# EAGLE design dac_board (EAGLE 8.0.1)
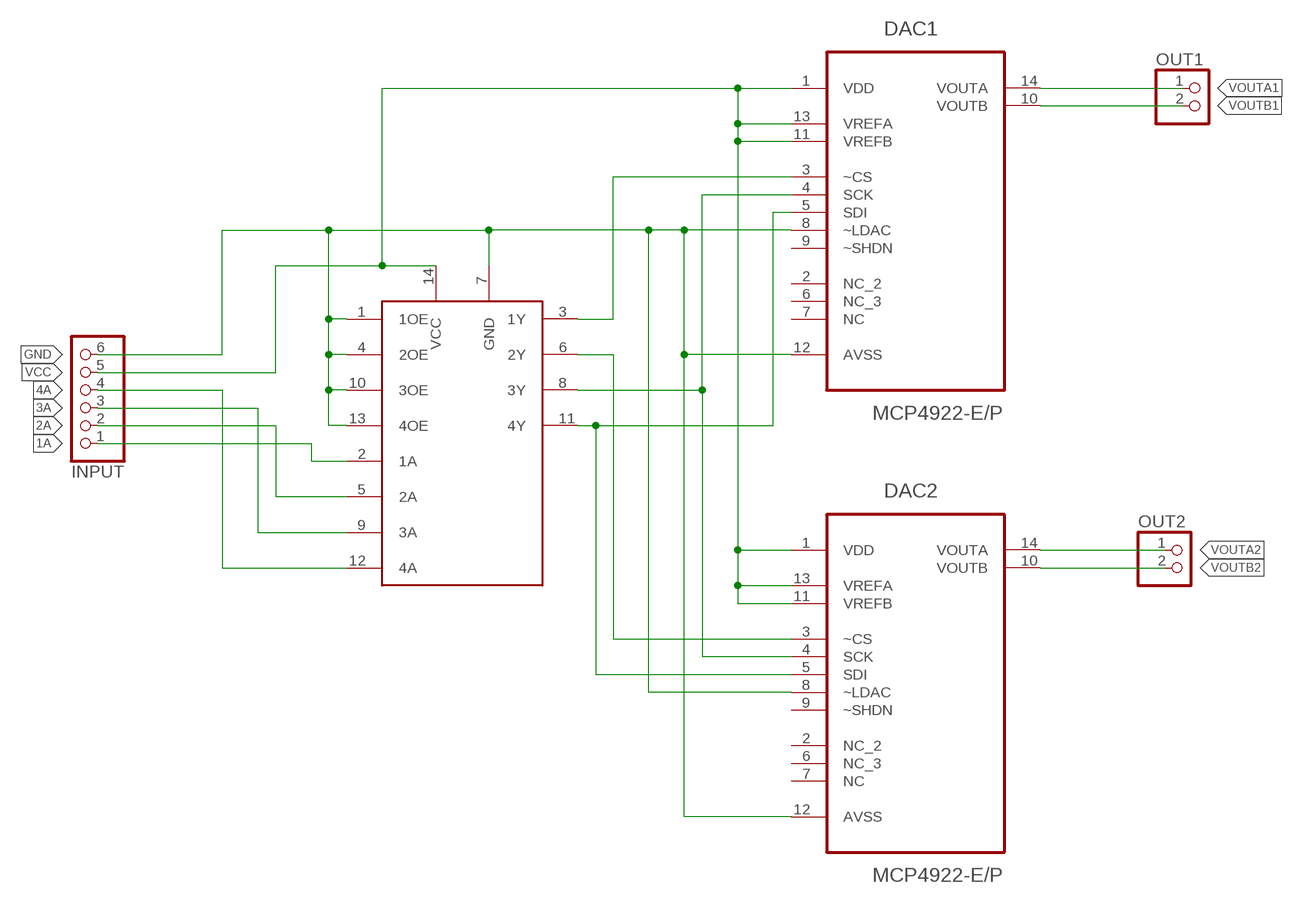
[diagram p0: schematic, sheet 1]

## Parts
DAC1  MCP4922-E/P  [DIP254P762X533-14]
DAC2  MCP4922-E/P  [DIP254P762X533-14]
INPUT  PINHD-1X6  [1X06]
LLS  SN74AHCT125  [DIP762W46P254L1930H508Q14]
OUT1  PINHD-1X2  [1X02]
OUT2  PINHD-1X2  [1X02]

## Nets
1A: INPUT.1 LLS.2(1A)
1Y: DAC1.3(~CS) LLS.3(1Y)
2A: INPUT.2 LLS.5(2A)
2Y: DAC2.3(~CS) LLS.6(2Y)
3A: INPUT.3 LLS.9(3A)
3Y: DAC1.4(SCK) DAC2.4(SCK) LLS.8(3Y)
4A: INPUT.4 LLS.12(4A)
4Y: DAC1.5(SDI) DAC2.5(SDI) LLS.11(4Y)
GND: DAC1.8(~LDAC) DAC1.12(AVSS) DAC2.8(~LDAC) DAC2.12(AVSS) INPUT.6 LLS.1(1OE) LLS.4(2OE) LLS.7(GND) LLS.10(3OE) LLS.13(4OE)
VCC: DAC1.1(VDD) DAC1.11(VREFB) DAC1.13(VREFA) DAC2.1(VDD) DAC2.11(VREFB) DAC2.13(VREFA) INPUT.5 LLS.14(VCC)
VOUTA1: DAC1.14(VOUTA) OUT1.1
VOUTA2: DAC2.14(VOUTA) OUT2.1
VOUTB1: DAC1.10(VOUTB) OUT1.2
VOUTB2: DAC2.10(VOUTB) OUT2.2
Unconnected: DAC1.2(NC_2) DAC1.6(NC_3) DAC1.7(NC) DAC1.9(~SHDN) DAC2.2(NC_2) DAC2.6(NC_3) DAC2.7(NC) DAC2.9(~SHDN)

## Library data of the parts
DAC1 DAC2 = MCP4922-E_P:MCP4922-E/P: 12-Bit DAC; AVAILABILITY: Good; DESCRIPTION: MCP4922 Series 2 Ch 12-Bit Voltage Output Digital-to-Analog Converter-PDIP-14; MF: Microchip; MP: MCP4922-E/P; PACKAGE: DIP-14 Microchip; PRICE: 2.40 USD
INPUT = pinhead:PINHD-1X6: PIN HEADER
LLS = SN74AHCT125N:SN74AHCT125: Quadruple bus buffer gates (logic level shifter)
OUT1 OUT2 = pinhead:PINHD-1X2: PIN HEADER

## Board
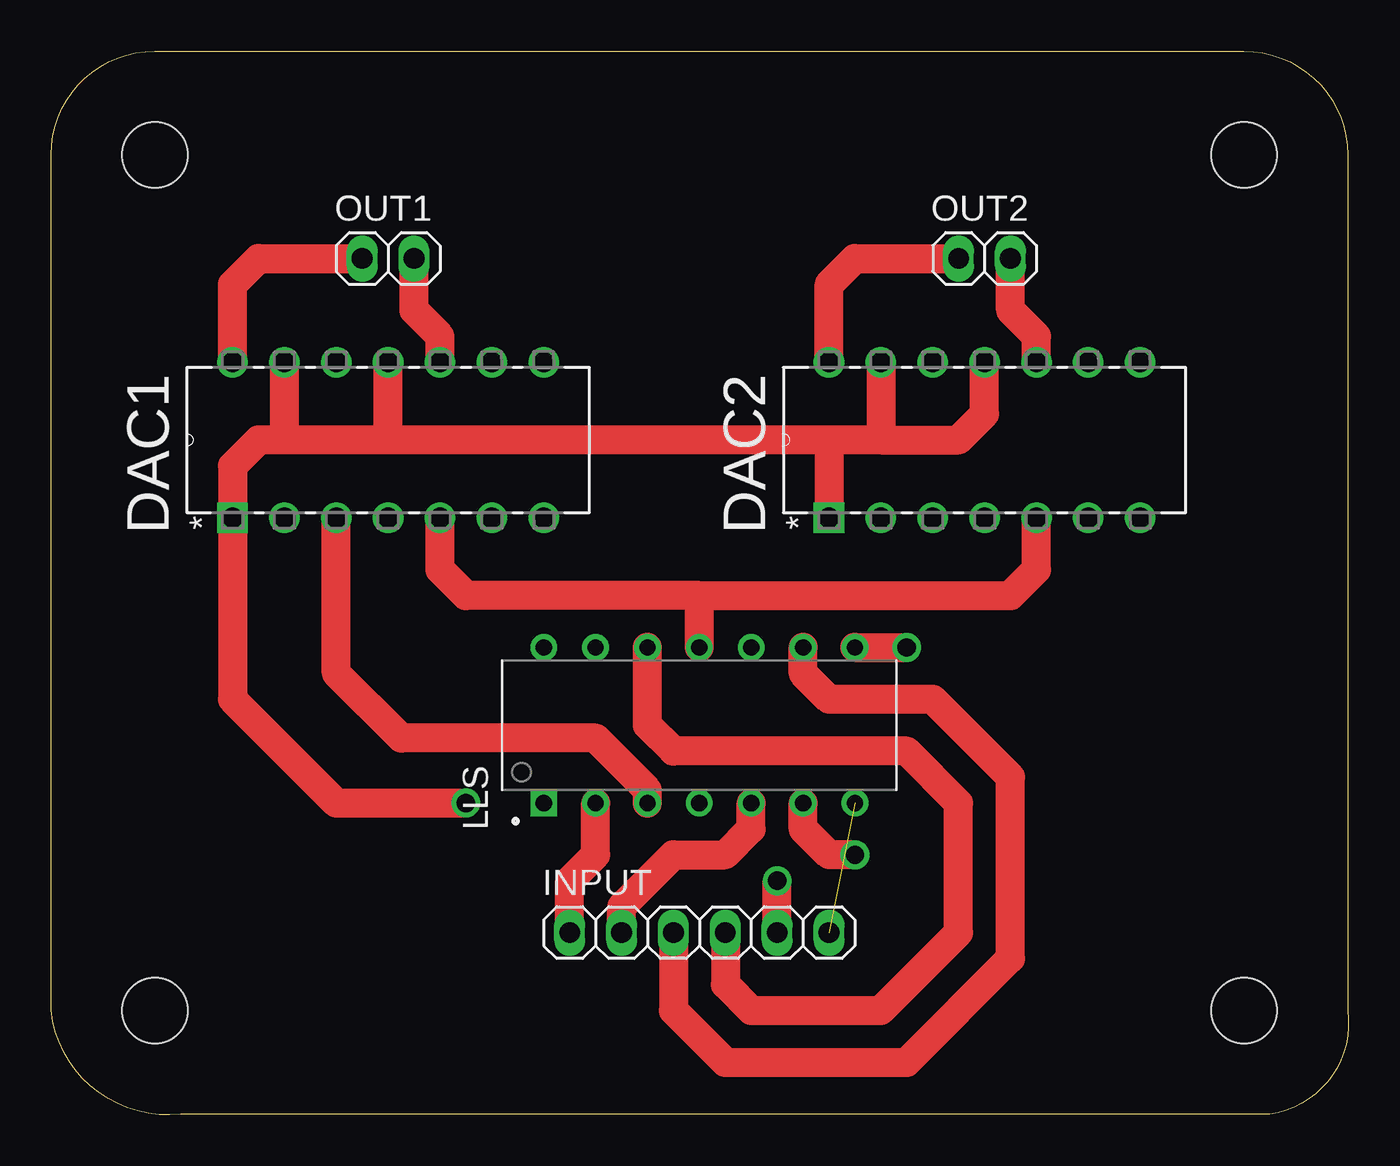
[diagram p1: board, top side]
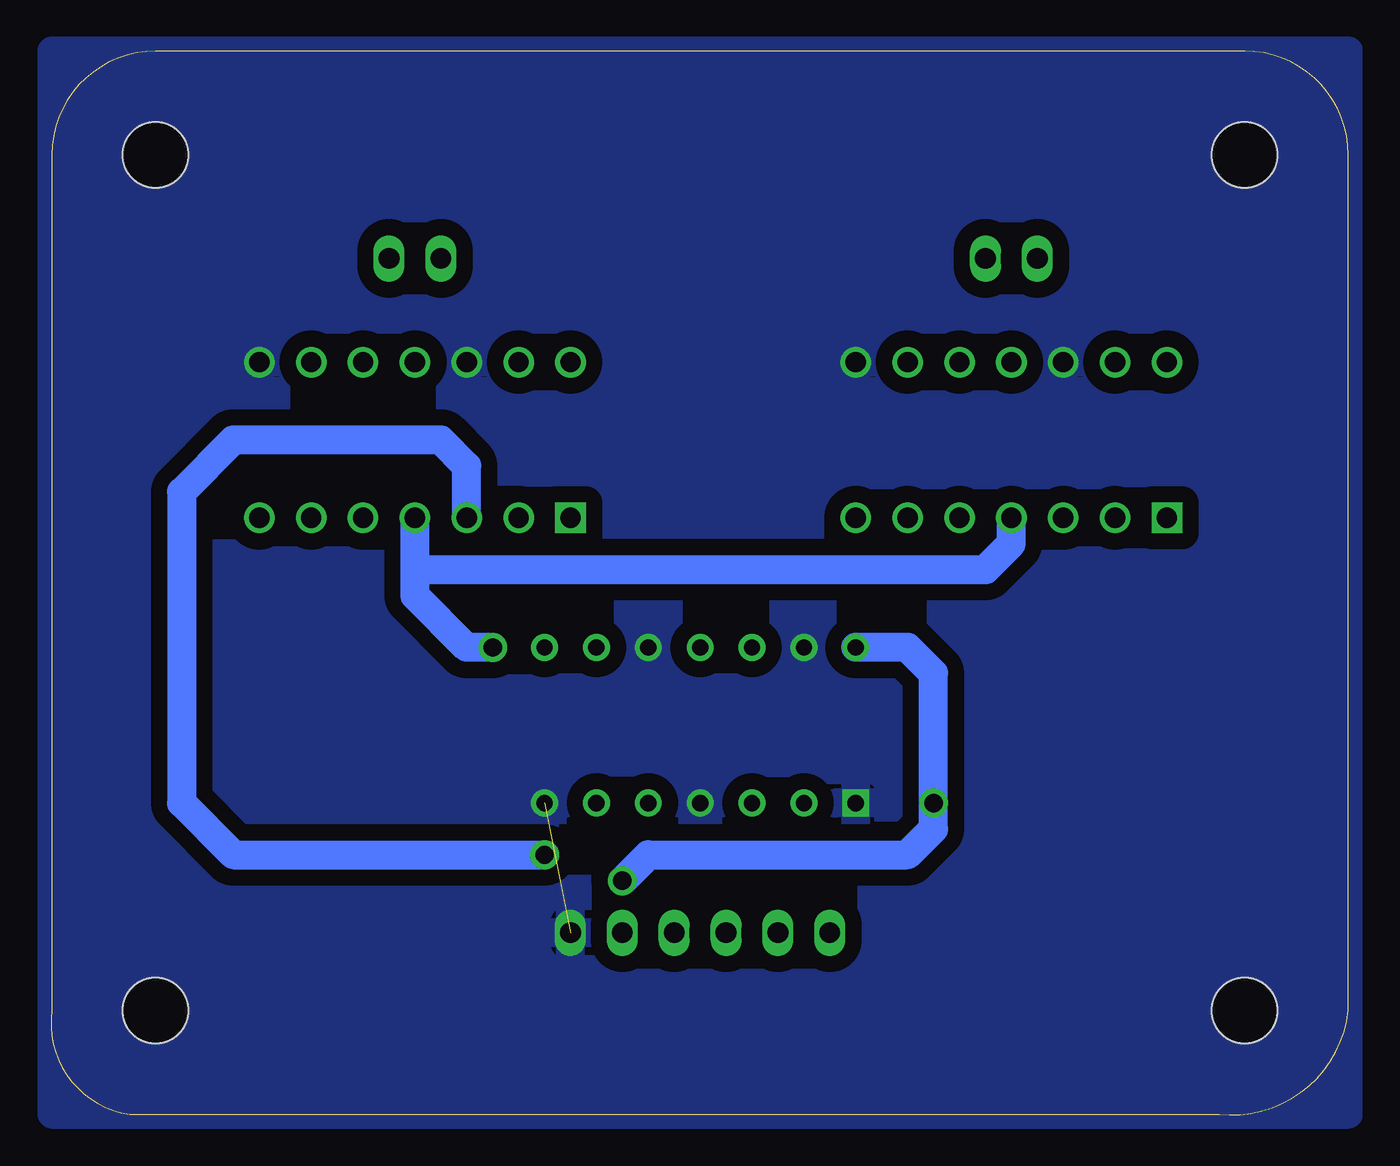
[diagram p2: board, bottom side, seen from below]

Size 63.54 x 52.1 mm. Coordinates in mm from the lower left corner, seen from the top.
Outline: 0,5.11 0,47.02 arc-90 5.08,52.1 58.42,52.1 arc-90 63.5,47.02 63.5,5.11 arc-90 59.69,0.03 6.35,0.03 arc-90 0,5.11
Copper layers (1*16): Top 0.035mm / dielectric 1.5mm / Bottom 0.035mm
Design rules "OthermillDRC_1_32_v2": minimum track width 8mil, minimum drill 0.8mm, track to track 0.794003125mm, track to pad 0.794003125mm, pad to pad 0.794003125mm, via to via 0.794003125mm, smd to smd 0mil, copper to edge 0mil, drill to drill 1mil, minimum pad ring 10mil, minimum via ring 10mil, stop-mask expansion 1mil, vias tented up to drill 30mil, thermal gap 10mil
Holes 3.2 mm at 5.08,47.02 58.42,47.02 58.42,5.11 5.08,5.11

### Footprints (pad centres in the part's own frame; a part is rotated, then mirrored left to right if it is on the bottom)
DIP254P762X533-14 = drill 0.991 square: 1 -7.62,15.24 | drill 0.991: 2 -7.62,12.7; 3 -7.62,10.16; 4 -7.62,7.62; 5 -7.62,5.08; 6 -7.62,2.54; 7 -7.62,0; 8 0,0; 9 0,2.54; 10 0,5.08; 11 0,7.62; 12 0,10.16; 13 0,12.7; 14 0,15.24
1X06 = drill 1.016 long: 1 -6.35,0; 2 -3.81,0; 3 -1.27,0; 4 1.27,0; 5 3.81,0; 6 6.35,0
DIP762W46P254L1930H508Q14 = drill 0.8 square: 1 -3.81,7.62 | drill 0.8: 2 -3.81,5.08; 3 -3.81,2.54; 4 -3.81,0; 5 -3.81,-2.54; 6 -3.81,-5.08; 7 -3.81,-7.62; 8 3.81,-7.62; 9 3.81,-5.08; 10 3.81,-2.54; 11 3.81,0; 12 3.81,2.54; 13 3.81,5.08; 14 3.81,7.62
1X02 = drill 1.016 long: 1 -1.27,0; 2 1.27,0

### Placement (x,y rotation side)
DAC1  24.13,36.86 90 top
DAC2  53.34,36.86 90 top
INPUT  31.75,8.92 0 top
LLS  31.75,19.08 90 top
OUT1  16.51,41.94 0 top
OUT2  45.72,41.94 0 top

### Tracks (layer width: path | path; a pad name or v marks a point on that pad's centre or on a via)
1A
  Top 1.422: INPUT.1 25.4,11.46 26.67,12.73 LLS.2
1Y
  Top 1.422: LLS.3 29.21,15.91 26.67,18.45 17.14,18.45 13.97,21.62 DAC1.3
2A
  Top 1.422: INPUT.2 27.94,10.19 30.48,12.73 33.02,12.73 34.29,14 LLS.5
2Y  (via drill 0.9)
  Top 1.422: v39.37,12.73 38.1,12.73 36.83,14 LLS.6
  Bottom 1.422: DAC2.3 43.18,31.78 44.45,33.05 54.61,33.05 57.15,30.51 57.15,15.27 54.61,12.73 v39.37,12.73
3A
  Top 1.422: INPUT.3 30.48,5.11 33.02,2.57 41.91,2.57 46.99,7.65 46.99,16.54 43.18,20.35 38.1,20.35 36.83,21.62 LLS.9
3Y  (via drill 0.9)
  Top 1.422: LLS.8 v41.91,22.89
  Bottom 1.422: v41.91,22.89 43.18,22.89 45.72,25.43 45.72,26.7 | 45.72,26.7 DAC2.4 | 45.72,26.7 17.78,26.7 16.51,27.97 DAC1.4
4A
  Top 1.422: INPUT.4 33.02,6.38 34.29,5.11 40.64,5.11 44.45,8.92 44.45,15.27 41.91,17.81 30.48,17.81 29.21,19.08 LLS.12
4Y
  Top 1.422: LLS.11 31.75,25.43 | 31.75,25.43 20.32,25.43 19.05,26.7 DAC1.5 | 31.75,25.43 46.99,25.43 48.26,26.7 DAC2.5
GND  (1 unrouted)
  pour Bottom: 0,0.03 0,52.1 63.5,52.1 63.5,0.03
VCC  (via drill 0.9)
  Top 1.422: INPUT.5 v35.56,11.46 | DAC2.13 40.64,33.05 | 40.64,33.05 38.1,33.05 | 38.1,33.05 DAC2.1 | 40.64,33.05 44.45,33.05 45.72,34.32 DAC2.11 | 38.1,33.05 16.51,33.05 | 16.51,33.05 DAC1.11 | 16.51,33.05 11.43,33.05 | 11.43,33.05 10.16,33.05 8.89,31.78 DAC1.1 8.89,20.35 13.97,15.27 v20.32,15.27 | 11.43,33.05 DAC1.13
  Bottom 1.422: v35.56,11.46 34.29,12.73 21.59,12.73 20.32,14 v20.32,15.27 20.32,21.62 21.59,22.89 LLS.14
VOUTA1
  Top 1.422: DAC1.14 8.89,40.67 10.16,41.94 OUT1.1
VOUTA2
  Top 1.422: DAC2.14 38.1,40.67 39.37,41.94 OUT2.1
VOUTB1
  Top 1.422: DAC1.10 19.05,38.13 17.78,39.4 OUT1.2
VOUTB2
  Top 1.422: DAC2.10 48.26,38.13 46.99,39.4 OUT2.2